# EAGLE design MUX2 (EAGLE 9.5.1)
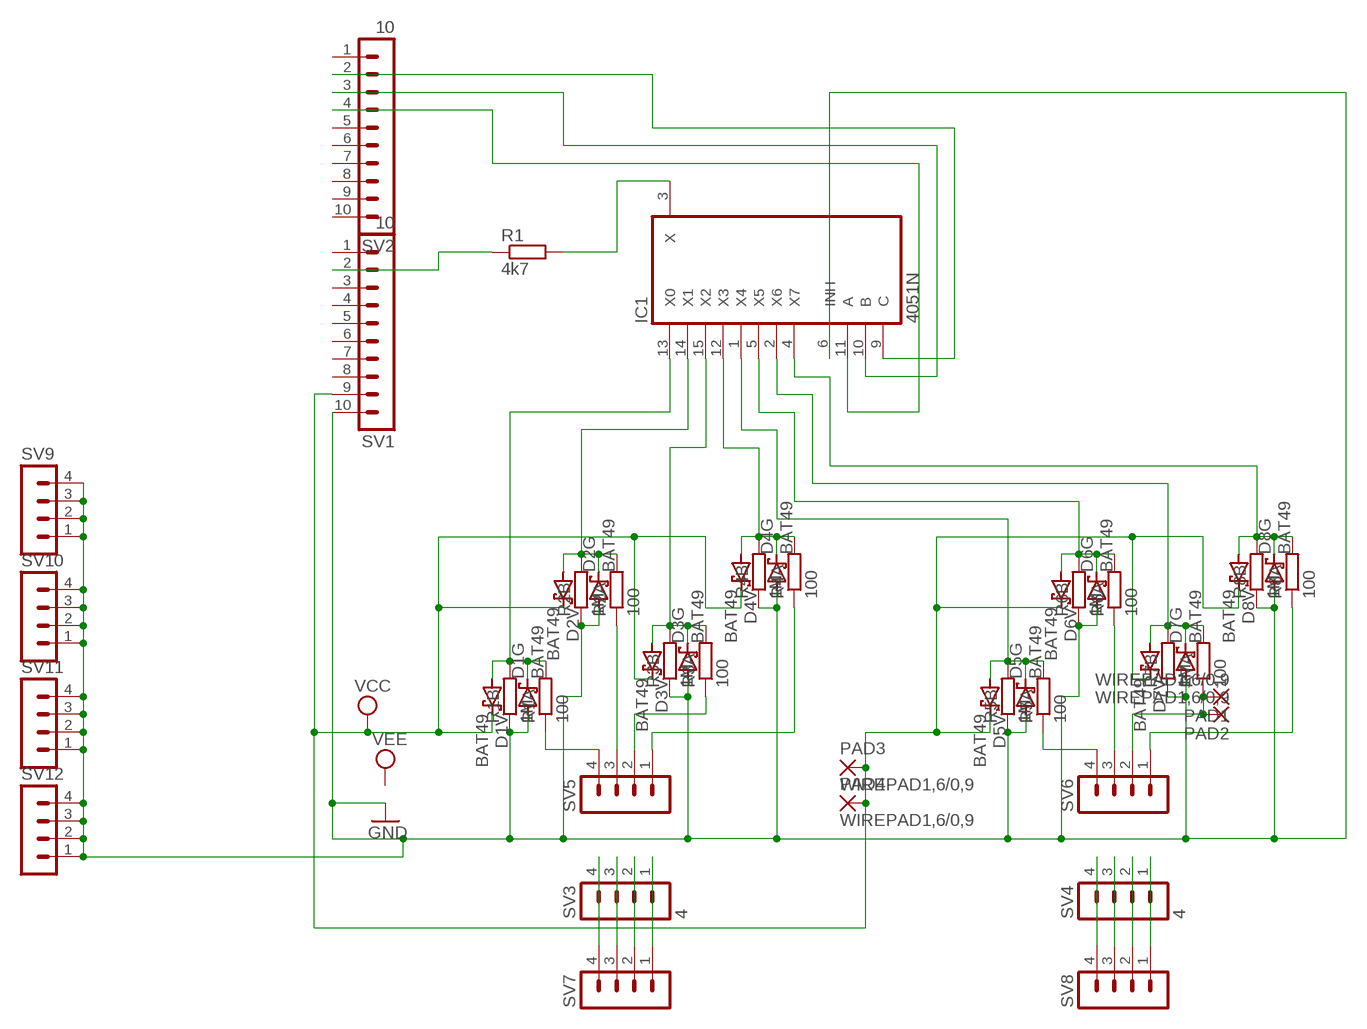
[diagram p0: schematic, sheet 1]

## Parts
D1G  BAT49  [DO41-10]
D1V  BAT49  [DO41-10]
D2G  BAT49  [DO41-10]
D2V  BAT49  [DO41-10]
D3G  BAT49  [DO41-10]
D3V  BAT49  [DO41-10]
D4G  BAT49  [DO41-10]
D4V  BAT49  [DO41-10]
D5G  BAT49  [DO41-10]
D5V  BAT49  [DO41-10]
D6G  BAT49  [DO41-10]
D6V  BAT49  [DO41-10]
D7G  BAT49  [DO41-10]
D7V  BAT49  [DO41-10]
D8G  BAT49  [DO41-10]
D8V  BAT49  [DO41-10]
IC1  4051N  [DIL16]
PAD1  WIREPAD1,6/0,9  [1,6/0,9]
PAD2  WIREPAD1,6/0,9  [1,6/0,9]
PAD3  WIREPAD1,6/0,9  [1,6/0,9]
PAD4  WIREPAD1,6/0,9  [1,6/0,9]
R1  4k7  R-EU_0204/7  [0204/7]
R1A  100  R-EU_0204/7  [0204/7]
R1B  1M  R-EU_0204/7  [0204/7]
R2A  100  R-EU_0204/7  [0204/7]
R2B  1M  R-EU_0204/7  [0204/7]
R3A  100  R-EU_0204/7  [0204/7]
R3B  1M  R-EU_0204/7  [0204/7]
R4A  100  R-EU_0204/7  [0204/7]
R4B  1M  R-EU_0204/7  [0204/7]
R5A  100  R-EU_0204/7  [0204/7]
R5B  1M  R-EU_0204/7  [0204/7]
R6A  100  R-EU_0204/7  [0204/7]
R6B  1M  R-EU_0204/7  [0204/7]
R7A  100  R-EU_0204/7  [0204/7]
R7B  1M  R-EU_0204/7  [0204/7]
R8A  100  R-EU_0204/7  [0204/7]
R8B  1M  R-EU_0204/7  [0204/7]
SV1  10  MA10-1  [MA10-1]
SV2  10  MA10-1  [MA10-1]
SV3  4  MA04-1  [MA04-1]
SV4  4  MA04-1  [MA04-1]
SV5  MA04-1  [MA04-1]
SV6  MA04-1  [MA04-1]
SV7  MA04-1  [MA04-1]
SV8  MA04-1  [MA04-1]
SV9  MA04-1  [MA04-1]
SV10  MA04-1  [MA04-1]
SV11  MA04-1  [MA04-1]
SV12  MA04-1  [MA04-1]

## Nets
GND: D1G.A D2G.A D3G.A D4G.A D5G.A D6G.A D7G.A D8G.A IC1.6(INH) R1B.1 R2B.1 R3B.1 R4B.1 R5B.1 R6B.1 R7B.1 R8B.1 SV1.10 SV9.1 SV9.2 SV9.3 SV9.4 SV10.1 SV10.2 SV10.3 SV10.4 SV11.1 SV11.2 SV11.3 SV11.4 SV12.1 SV12.2 SV12.3 SV12.4
N$1: R1A.1 SV5.4
N$2: R1.1 SV1.2
N$3: R2A.1 SV5.3
N$4: R3A.1 SV5.2
N$5: R5A.1 SV6.4
N$6: D2G.C D2V.A IC1.14(X1) R2A.2 R2B.2
N$7: D1G.C D1V.A IC1.13(X0) R1A.2 R1B.2
N$8: R4A.1 SV5.1
N$9: D5G.C D5V.A IC1.1(X4) R5A.2 R5B.2
N$10: IC1.9(C) SV2.2
N$11: D6G.C D6V.A IC1.5(X5) R6A.2 R6B.2
N$12: IC1.10(B) SV2.3
N$13: R6A.1 SV6.3
N$14: D8G.C D8V.A IC1.4(X7) R8A.2 R8B.2
N$15: PAD1.1(P) PAD2.1(P) R7A.1 SV6.2
N$16: R8A.1 SV6.1
N$17: D7G.C D7V.A IC1.2(X6) R7A.2 R7B.2
N$18: SV3.4 SV7.4
N$19: IC1.11(A) SV2.4
N$20: SV3.3 SV7.3
N$21: SV3.2 SV7.2
N$22: SV3.1 SV7.1
N$23: SV4.4 SV8.4
N$24: IC1.3(X) R1.2
N$25: SV4.3 SV8.3
N$26: D4G.C D4V.A IC1.12(X3) R4A.2 R4B.2
N$27: SV4.2 SV8.2
N$28: SV4.1 SV8.1
N$29: D3G.C D3V.A IC1.15(X2) R3A.2 R3B.2
VCC: D1V.C D2V.C D3V.C D4V.C D5V.C D6V.C D7V.C D8V.C PAD3.1(P) PAD4.1(P) SV1.9
Unconnected: SV1.1 SV1.3 SV1.4 SV1.5 SV1.6 SV1.7 SV1.8 SV2.1 SV2.5 SV2.6 SV2.7 SV2.8 SV2.9 SV2.10

## Power pins joined to a net without a drawn wire
GND: IC1.8(GND)
VCC: IC1.16(VCC)
VEE: IC1.7(VEE)

## Library data of the parts
D1G D1V D2G D2V D3G D3V D4G D4V D5G D5V D6G D6V D7G D7V D8G D8V = diode:BAT49: DIODE small signal diode
IC1 = 40xx:4051: 8-channel ANALOG MULTIPLEXER
PAD1-PAD4 = wirepad:WIREPAD: Wire PAD connect wire on PCB
R1 R1A R1B R2A R2B R3A R3B R4A R4B R5A R5B R6A R6B R7A R7B R8A R8B = rcl:R-EU_: RESISTOR, European symbol; SPICEPREFIX: R
SV1 SV2 = con-lstb:MA10-1: PIN HEADER; OC_FARNELL: unknown; OC_NEWARK: unknown
SV3-SV12 = con-lstb:MA04-1: PIN HEADER; OC_FARNELL: unknown; OC_NEWARK: unknown

## Board
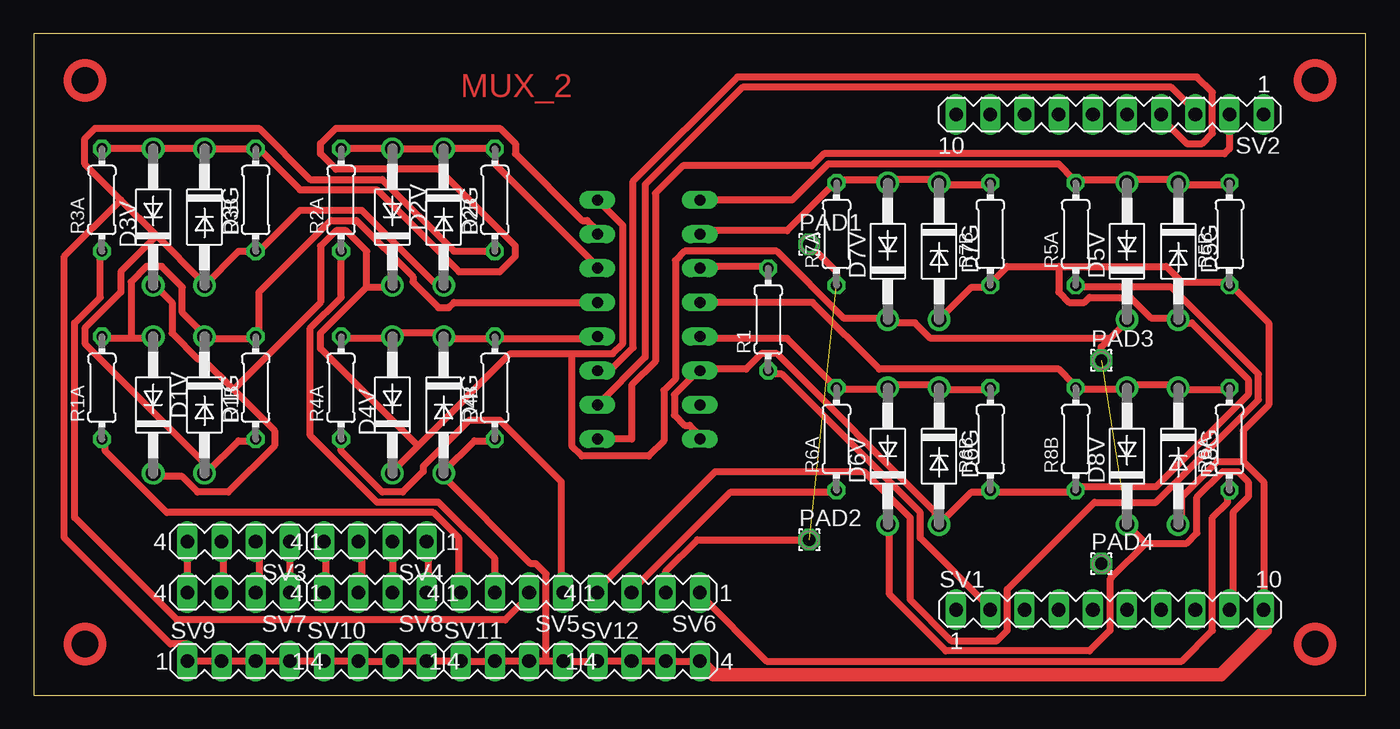
[diagram p1: board, top side]
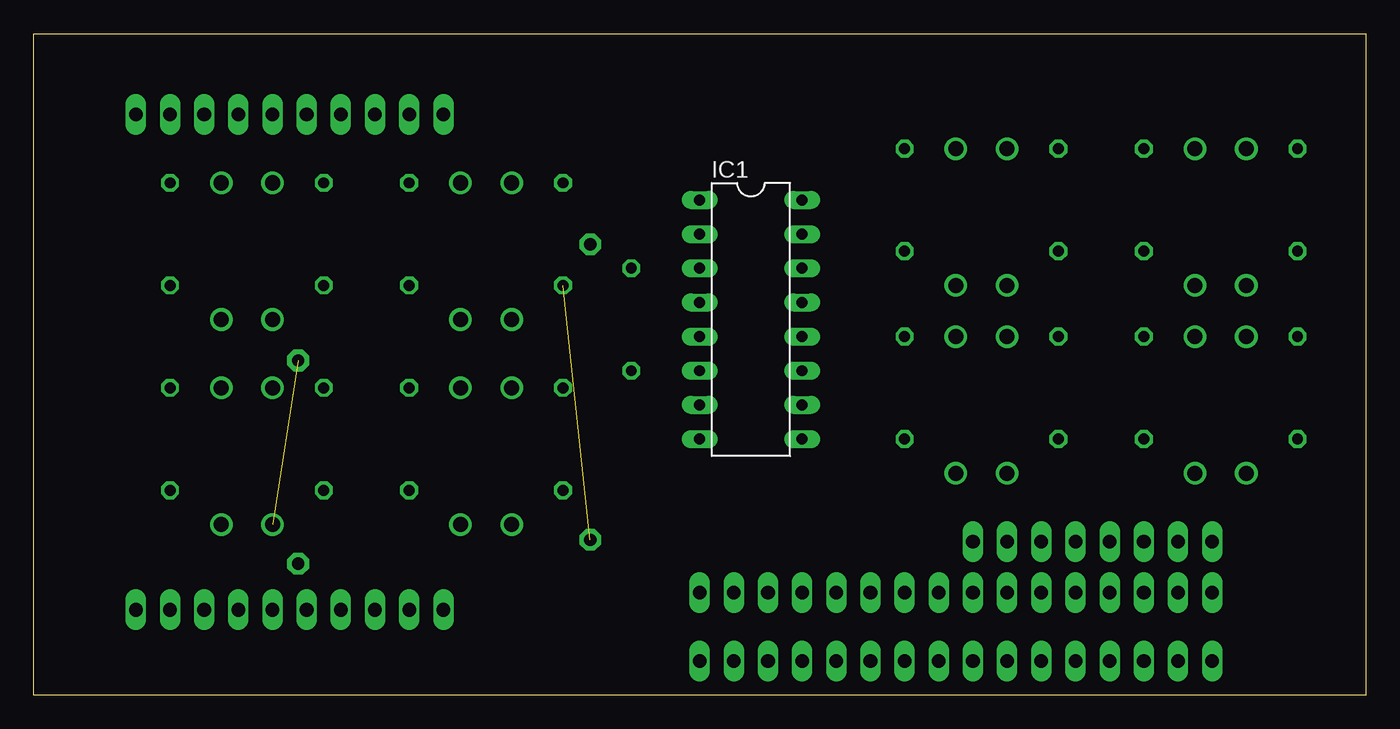
[diagram p2: board, bottom side, seen from below]

Size 99.04 x 49.2 mm. Coordinates in mm from the lower left corner, seen from the top.
Outline: 0,0 99.04,0 99.04,49.2 0,49.2 0,0
Copper layers (1*16): Top 0.035mm / dielectric 1.5mm / Bottom 0.035mm
Design rules "default *": minimum track width 20mil, minimum drill 0.5mm, track to track 10mil, track to pad 10mil, pad to pad 10mil, via to via 10mil, smd to smd 10mil, copper to edge 40mil, drill to drill 6mil, minimum pad ring 10mil, minimum via ring 8mil, stop-mask expansion 4mil, vias tented up to drill 0mil, thermal gap 10mil

### Footprints (pad centres in the part's own frame; a part is rotated, then mirrored left to right if it is on the bottom)
DO41-10 = drill 1.118: A 5.08,0; C -5.08,0
DIL16 = drill 0.813 long: 1 -8.89,-3.81; 2 -6.35,-3.81; 3 -3.81,-3.81; 4 -1.27,-3.81; 5 1.27,-3.81; 6 3.81,-3.81; 7 6.35,-3.81; 8 8.89,-3.81; 9 8.89,3.81; 10 6.35,3.81; 11 3.81,3.81; 12 1.27,3.81; 13 -1.27,3.81; 14 -3.81,3.81; 15 -6.35,3.81; 16 -8.89,3.81
1,6/0,9 = drill 0.914 pad 1.6 octagon: 1 0,0
0204/7 = drill 0.813 octagon: 1 -3.81,0; 2 3.81,0
MA10-1 = drill 1.016 long: 1 -11.43,0; 2 -8.89,0; 3 -6.35,0; 4 -3.81,0; 5 -1.27,0; 6 1.27,0; 7 3.81,0; 8 6.35,0; 9 8.89,0; 10 11.43,0
MA04-1 = drill 1.016 long: 1 -3.81,0; 2 -1.27,0; 3 1.27,0; 4 3.81,0

### Placement (x,y rotation side)
D1G  12.7,21.59 270 top
D1V  8.89,21.59 90 top
D2G  30.48,35.56 270 top
D2V  26.67,35.56 90 top
D3G  12.7,35.56 270 top
D3V  8.89,35.56 90 top
D4G  30.48,21.59 270 top
D4V  26.67,21.59 90 top
D5G  85.09,33.02 270 top
D5V  81.28,33.02 90 top
D6G  67.31,17.78 270 top
D6V  63.5,17.78 90 top
D7G  67.31,33.02 270 top
D7V  63.5,33.02 90 top
D8G  85.09,17.78 270 top
D8V  81.28,17.78 90 top
IC1  45.72,27.94 270 bottom
PAD1  57.66,33.53 0 top
PAD2  57.66,11.56 0 top
PAD3  79.38,24.89 0 top
PAD4  79.38,9.78 0 top
R1  54.61,27.94 90 top
R1A  5.08,22.86 90 top
R1B  16.51,22.86 90 top
R2A  22.86,36.83 90 top
R2B  34.29,36.83 90 top
R3A  5.08,36.83 90 top
R3B  16.51,36.83 90 top
R4A  22.86,22.86 90 top
R4B  34.29,22.86 90 top
R5A  77.47,34.29 90 top
R5B  88.9,34.29 90 top
R6A  59.69,19.05 90 top
R6B  71.12,19.05 90 top
R7A  59.69,34.29 90 top
R7B  71.12,34.29 90 top
R8A  88.9,19.05 90 top
R8B  77.47,19.05 90 top
SV1  80.01,6.35 0 top
SV2  80.01,43.18 180 top
SV3  15.24,11.43 180 top
SV4  25.4,11.43 180 top
SV5  35.56,7.62 180 top
SV6  45.72,7.62 180 top
SV7  15.24,7.62 180 top
SV8  25.4,7.62 180 top
SV9  15.24,2.54 0 top
SV10  25.4,2.54 0 top
SV11  35.56,2.54 0 top
SV12  45.72,2.54 0 top

### Tracks (layer width: path | path; a pad name or v marks a point on that pad's centre or on a via)
GND
  Top 0.508: 49.53,24.26 47.62,22.35 47.62,20.83 48.39,20.07 48.77,20.07 49.53,19.3 IC1.8 | 49.53,24.26 52.96,24.26 54.1,25.4 55.24,25.4 67.06,13.59 67.06,12.83 D6G.A 69.72,15.11 70.87,15.11 R6B.1 71.25,15.11 77.34,15.11 R8B.1 77.72,15.49 83.44,15.49 90.3,22.35 90.3,23.5 86.11,27.69 85.34,27.69 D5G.A 84.96,28.07 83.06,28.07 81.53,29.59 78.49,29.59 78.11,29.21 76.96,29.21 76.2,29.97 76.2,31.88 | 49.53,24.26 IC1.6 | 89.92,17.4 91.44,15.88 SV1.10 91.57,6.22 91.57,4.83 | 89.92,17.4 88.01,17.4 85.34,14.73 85.34,12.83 D8G.A | D7G.A 69.72,30.35 70.87,30.35 R7B.1 71.25,30.73 72.39,31.88 76.2,31.88 | 76.2,31.88 84.2,31.88 85.34,30.73 88.77,30.73 R5B.1 89.15,30.35 91.82,27.69 91.82,21.59 89.92,19.69 89.92,17.4 | R1B.1 16.38,18.92 15.24,18.92 12.95,16.64 D1G.A 12.57,16.64 12.57,17.4 3.81,26.16 3.81,27.3 6.48,29.97 6.48,31.5 9.14,34.16 | R2B.1 31.24,33.02 25.91,38.35 20.57,38.35 16.76,42.16 4.57,42.16 3.81,41.4 3.81,39.5 6.48,36.83 | 9.14,34.16 12.57,30.73 D3G.A 15.24,33.02 R3B.1 16.76,33.02 19.81,36.07 24.38,36.07 29.72,30.73 30.48,30.73 D2G.A | 9.14,34.16 6.48,36.83 | R4B.1 34.29,18.92 32.77,18.92 30.48,16.64 D4G.A 30.48,16.26 36.96,9.78 37.34,9.78 38.1,9.02 38.1,2.54 | 38.1,2.54 SV11.4 SV12.1 SV12.2 SV12.3 SV12.4 | 38.1,2.54 SV11.3 SV11.2 SV11.1 SV10.4 SV10.3 SV10.2 SV10.1 SV9.4 SV9.3 SV9.2 SV9.1 11.43,3.81 10.16,3.81 2.29,11.68 2.29,32.64 6.48,36.83
  Top 1.016: 91.57,4.83 88.27,1.52 50.55,1.52 SV12.4
N$1
  Top 0.508: R1A.1 5.33,18.92 5.33,18.16 9.91,13.59 29.72,13.59 31.62,11.68 31.62,7.87 SV5.4
N$2
  Top 0.508: R1.1 54.86,23.88 55.63,23.88 65.91,13.59 65.91,11.68 71.25,6.35 SV1.2
N$3
  Top 0.508: R2A.1 22.86,29.59 20.57,27.3 20.57,19.3 25.53,14.35 30.1,14.35 34.29,10.16 SV5.3
N$4
  Top 0.508: R3A.1 4.95,33.02 4.95,29.59 3.05,27.69 3.05,13.21 10.67,5.59 35.05,5.59 36.96,7.49 SV5.2
N$5
  Top 0.508: R5A.1 77.72,30.35 84.58,30.35 91.06,23.88 91.06,21.97 83.44,14.35 78.87,14.35 72.39,7.87 72.39,4.83 71.63,4.06 68.2,4.06 65.15,7.11 65.15,13.21 61.72,16.64 50.67,16.64 41.91,7.87 SV6.4
N$6
  Top 0.508: R2A.2 D2V.A D2G.C R2B.2 34.29,39.5 41.91,31.88 IC1.14
N$7
  Top 0.508: 7.24,26.54 8.76,26.54 D1V.A | 7.24,26.54 5.33,26.54 R1A.2 | IC1.13 31.24,29.21 30.86,28.83 30.1,28.83 28.19,30.73 28.19,31.12 24,35.31 22.1,35.31 16.76,29.97 16.76,26.92 R1B.2 16.38,26.54 12.95,26.54 D1G.C 12.57,26.92 11.05,28.45 11.05,30.35 9.53,31.88 8.38,31.88 7.24,30.73 7.24,26.54
N$8
  Top 0.508: R4A.1 22.86,18.16 25.91,15.11 27.43,15.11 28.96,16.64 28.96,17.02 32.38,20.45 34.67,20.45 39.24,15.88 39.24,7.87 SV5.1
N$9
  Top 0.508: R5B.2 88.77,37.97 85.34,37.97 D5G.C 84.96,38.35 81.53,38.35 D5V.A 81.15,38.35 77.72,38.35 R5A.2 77.34,38.35 76.2,39.5 59.05,39.5 56.39,36.83 IC1.1
N$10
  Top 0.508: SV2.2 88.9,40.64 88.52,40.26 58.74,40.26 57.85,39.37 48.26,39.37 46.23,37.34 46.23,24.83 44.45,23.05 44.45,19.05 IC1.9
N$11
  Top 0.508: R6B.2 70.87,22.73 67.44,22.73 D6G.C 67.06,23.11 63.63,23.11 D6V.A 63.25,22.73 59.82,22.73 R6A.2 56.01,26.54 49.53,26.54 IC1.5
N$12
  Top 0.508: IC1.10 45.47,25.15 45.47,37.97 52.7,45.21 84.58,45.21 86.49,43.31 SV2.3
N$13
  Top 0.508: R6A.1 59.44,15.11 51.82,15.11 44.58,7.87 SV6.3
N$14
  Top 0.508: R8A.2 88.77,22.73 85.34,22.73 D8G.C 84.96,23.11 81.53,23.11 D8V.A 81.15,22.73 77.72,22.73 R8B.2 77.34,23.11 76.2,24.26 62.87,24.26 57.91,29.21 IC1.4
N$15  (1 unrouted)
  Top 0.508: SV6.2 46.99,9.21 49.34,11.56 PAD2.1 | PAD1.1 59.69,31.5 R7A.1
N$16
  Top 0.508: R8A.1 88.77,15.11 88.77,14.35 87.63,13.21 87.63,4.83 85.34,2.54 54.48,2.54 49.53,7.49 SV6.1
N$17
  Top 0.508: R7B.2 70.87,37.97 67.44,37.97 D7G.C 67.06,38.35 63.63,38.35 D7V.A 63.25,38.35 59.82,38.35 R7A.2 59.44,37.97 56.01,34.54 49.53,34.54 IC1.2
N$18
  Top 0.508: SV3.4 SV7.4
N$19
  Top 0.508: SV2.4 83.82,42.93 85.72,41.02 86.87,41.02 87.63,41.78 87.63,44.83 86.49,45.97 52.32,45.97 44.58,38.23 44.58,25.85 42.86,24.13 IC1.11
N$20
  Top 0.508: SV7.3 14.1,7.87 14.1,11.3 SV3.3
N$21
  Top 0.508: SV7.2 16.76,7.87 16.76,11.3 SV3.2
N$22
  Top 0.508: SV3.1 SV7.1
N$23
  Top 0.508: SV8.4 21.72,7.87 21.72,11.3 SV4.4
N$24
  Top 0.508: IC1.3 49.53,31.88 54.48,31.88 R1.2
N$25
  Top 0.508: SV8.3 24.38,7.87 24.38,11.3 SV4.3
N$26
  Top 0.508: R4A.2 22.86,26.54 26.67,26.54 D4V.A 26.67,26.92 30.48,26.92 D4G.C 30.48,26.54 34.29,26.54 | 34.29,26.54 41.91,26.54 IC1.12 | 34.29,26.54 R4B.2
N$27
  Top 0.508: SV4.2 SV8.2
N$28
  Top 0.508: SV8.1 29.34,7.87 29.34,11.3 SV4.1
N$29
  Top 0.508: R3A.2 D3V.A D3G.C R3B.2 16.76,40.64 19.81,37.59 25.53,37.59 31.62,31.5 34.67,31.5 35.81,32.64 35.81,33.4 30.1,39.12 22.48,39.12 21.34,40.26 21.34,41.02 22.48,42.16 34.67,42.16 35.81,41.02 35.81,40.26 40.77,35.31 41.15,35.31 41.91,34.54 IC1.15
VCC  (1 unrouted)
  Top 0.508: 82.68,11.3 85.72,11.3 86.49,12.07 86.49,14.73 88.39,16.64 89.53,16.64 90.3,15.88 90.3,14.73 89.15,13.59 89.15,6.35 SV1.9 | D8V.C 82.68,11.3 | 82.68,11.3 80.14,8.76 | 80.14,8.76 80.01,8.64 80.01,4.83 78.49,3.3 67.82,3.3 63.63,7.49 63.63,12.45 D6V.C | 14.86,22.73 12.57,25.02 12.19,25.02 10.29,26.92 10.29,29.21 9.14,30.35 D3V.C | 14.86,22.73 17.91,19.69 17.91,18.54 14.48,15.11 12.19,15.11 11.05,16.26 9.14,16.26 D1V.C | 80.01,26.54 66.67,26.54 65.53,27.69 63.63,27.69 D7V.C 63.25,28.07 60.2,28.07 55.24,33.02 48.39,33.02 47.7,32.33 47.7,23.51 46.86,22.67 46.86,18.92 45.72,17.78 40.77,17.78 40.01,18.54 40.01,25.4 | 80.01,26.54 81.15,27.69 D5V.C | IC1.16 43.81,34.93 43.81,26.16 43.05,25.4 40.01,25.4 | 40.01,25.4 35.43,25.4 28.57,18.54 | 28.57,18.54 26.67,16.64 D4V.C | 24.77,30.35 26.67,30.35 D2V.C | 24.77,30.35 21.34,26.92 21.34,25.78 28.57,18.54 | 14.86,22.73 21.34,29.21 21.34,33.4 22.48,34.54 23.24,34.54 24.77,33.02 24.77,30.35 | PAD3.1 79.38,25.91 80.01,26.54 | PAD4.1 80.14,9.02 80.14,8.76
(copper drawn outside any net)
  shapes: Top circle x4

### Text on the board
Top: MUX_2